# EAGLE design accumulator-undervoltage-protection (EAGLE 5.06)
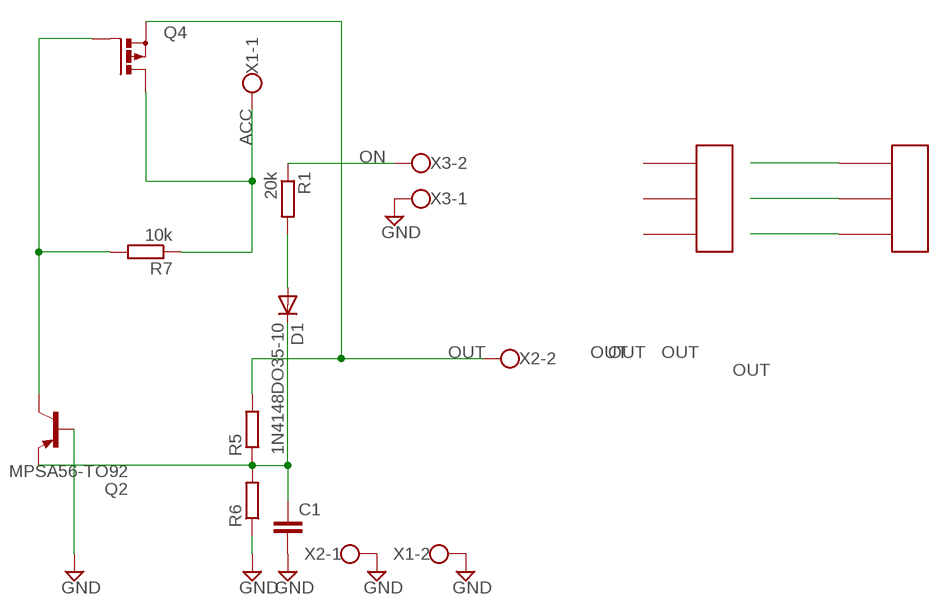
[diagram p0: schematic, sheet 1]

## Parts
C1  C-EU050-024X044  [C050-024X044]
D1  1N4148DO35-10  [DO35-10]
Q2  MPSA56-TO92  [TO92-CBE]
Q4  PMOSFET_PTO220BV  [TO220BV]
R1  20k  R-EU_0207/10  [0207/10]
R5  R-EU_0207/12  [0207/12]
R6  R-EU_0207/12  [0207/12]
R7  10k  R-EU_0207/12  [0207/12]
U$1  MA03-1  [MA03-1]
U$2  MA03-1  [MA03-1]
X1  W237-02P  [W237-132]
X2  W237-02P  [W237-132]
X3  W237-02P  [W237-132]

## Nets
ACC: Q4.D R7.1 U$2.P3 X1.1
GND: C1.2 Q2.B R6.1 X1.2 X2.1 X3.1
N$1: Q2.C Q4.G R7.2
N$3: D1.A R1.2
ON: R1.1 U$2.P1 U$2.P2 X3.2
OUT: Q4.S R5.2 X2.2
VREF: C1.1 D1.C Q2.E R5.1 R6.2
Unconnected: U$1.P1 U$1.P2 U$1.P3

## Library data of the parts
C1 = rcl:C-EU: CAPACITOR, European symbol
D1 = diode:1N4148: DIODE high speed (Philips)
Q2 = transistor-pnp:*-?: PNP Transistor
Q4 = transistor-power:PMOSFET_P: Power MOSFET P-Channel
R1 = rcl:R-EU_: RESISTOR, European symbol
R5-R7 = resistor:R-EU_: RESISTOR, European symbol
U$1 U$2 = my-con:MA03-1
X1-X3 = con-wago-508:W237-02P: WAGO SREW CLAMP

## Board
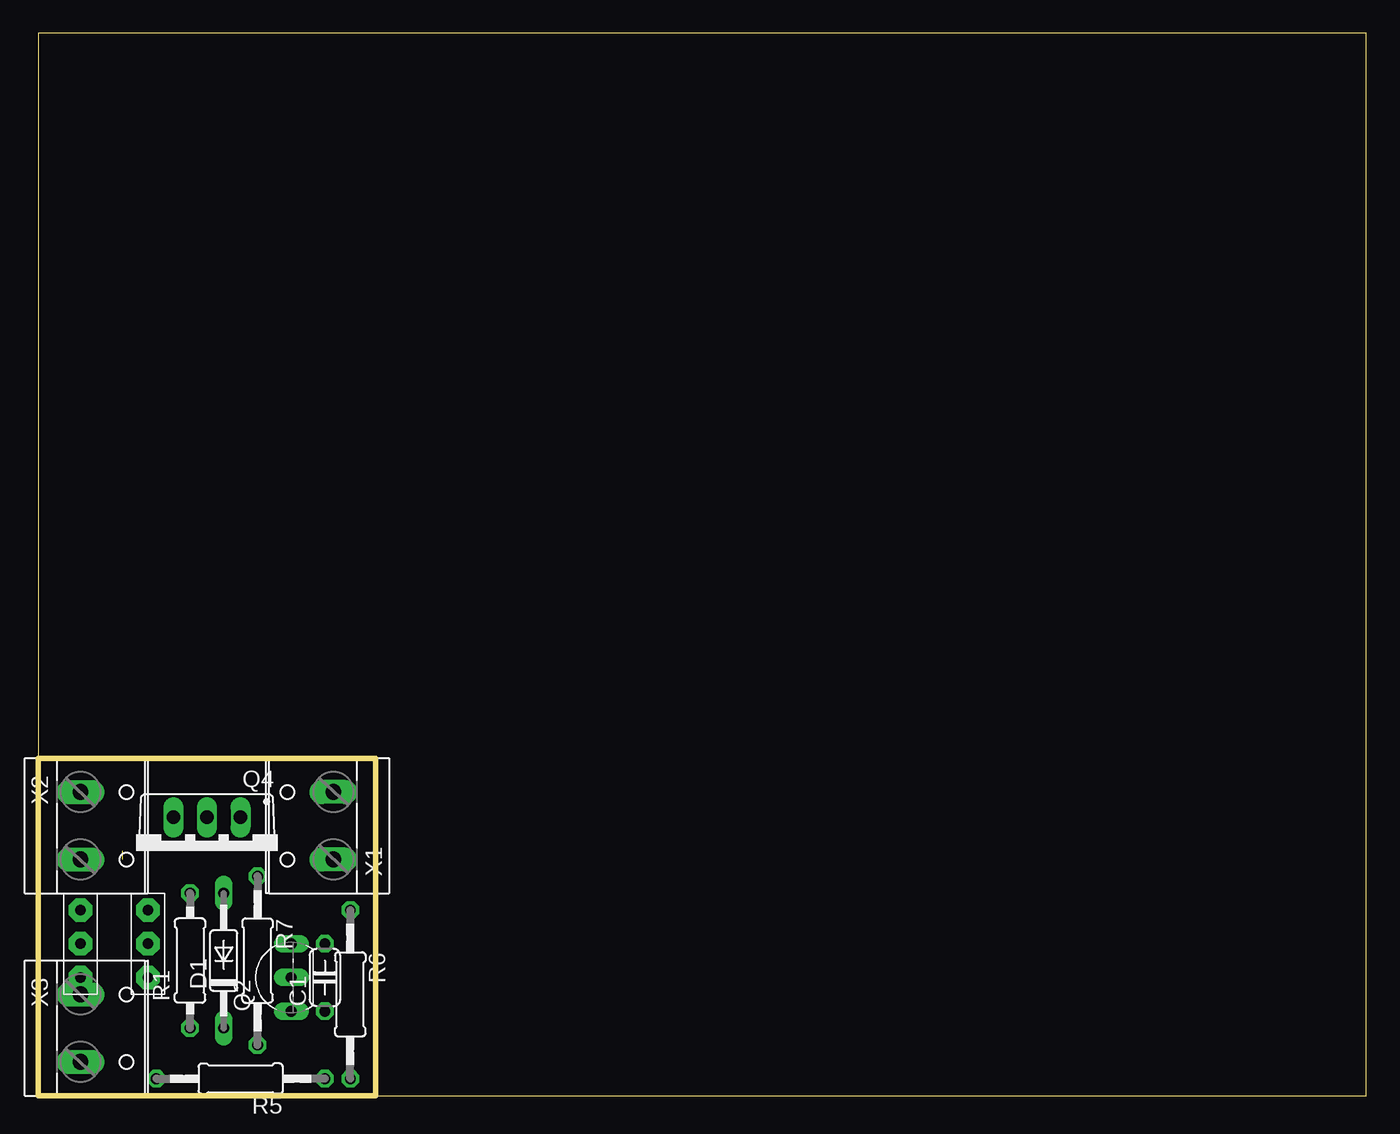
[diagram p1: board, top side]
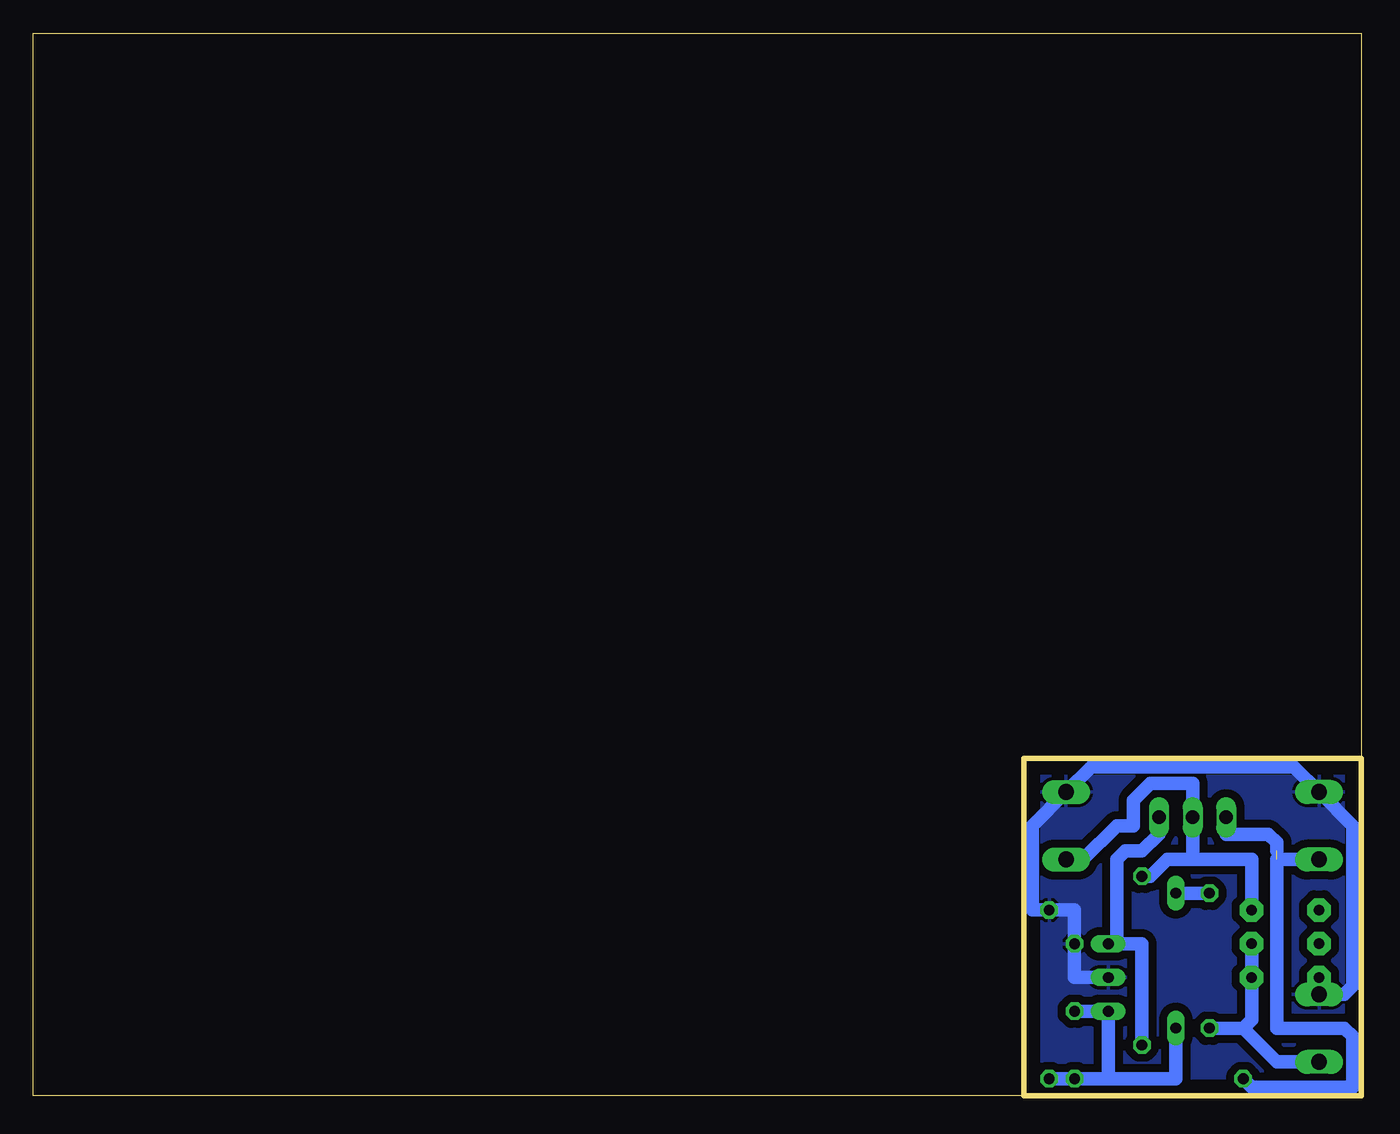
[diagram p2: board, bottom side, seen from below]

Size 100 x 80 mm. Coordinates in mm from the lower left corner, seen from the top.
Outline: 0,0 25.4,0
Outline: 25.4,0 100,0 100,80 0,80 0,25.4
Outline: 0,25.4 0,0
Outline: 0,0 25.4,0
Outline: 25.4,0 25.4,25.4 0,25.4
Outline: 0,25.4 0,0
Copper layers (1*16): Top 0.035mm / dielectric 1.5mm / Bottom 0.035mm
Design rules "default": minimum track width 10mil, minimum drill 24mil, track to track 8mil, track to pad 8mil, pad to pad 8mil, via to via 8mil, smd to smd 8mil, copper to edge 40mil, drill to drill 8mil, minimum pad ring 10mil, minimum via ring 8mil, stop-mask expansion 4mil, vias tented up to drill 0mil, thermal gap 10mil

### Footprints (pad centres in the part's own frame; a part is rotated, then mirrored left to right if it is on the bottom)
C050-024X044 = drill 0.813 octagon: 1 -2.54,0; 2 2.54,0
DO35-10 = drill 0.813 long: A 5.08,0; C -5.08,0
TO92-CBE = drill 0.813 long: B 0,0; C 2.54,0; E -2.54,0
TO220BV = drill 1.016 long: D 0,-2.54; G -2.54,-2.54; S 2.54,-2.54
0207/10 = drill 0.813 octagon: 1 -5.08,0; 2 5.08,0
0207/12 = drill 0.813 octagon: 1 -6.35,0; 2 6.35,0
MA03-1 = drill 0.8 pad 1.778 octagon: P1 -2.54,0; P2 0,0; P3 2.54,0
W237-132 = drill 1.194 long: 1 -2.54,-0.635; 2 2.54,-0.635

### Placement (x,y rotation side)
C1  21.59,8.89 90 top
D1  13.97,10.16 90 top
Q2  19.05,8.89 90 top
Q4  12.7,18.41 180 top
R1  11.43,10.16 90 top
R5  15.24,1.27 180 top
R6  23.5,7.62 270 top
R7  16.51,10.16 270 top
U$1  3.17,11.43 90 top
U$2  8.26,11.43 90 top
X1  21.59,20.32 90 top
X2  3.81,20.32 270 top
X3  3.81,5.08 270 top

### Tracks (layer width: path | path; a pad name or v marks a point on that pad's centre or on a via)
ACC
  Bottom 1.016: R7.1 15.88,16.51 14.61,17.78 13.97,17.78 12.7,17.78 | U$2.P3 8.26,17.78 12.7,17.78 | 12.7,17.78 Q4.D 12.7,23.5 15.88,23.5 17.14,22.23 17.14,20.32 18.41,20.32 20.95,17.78 X1.1
GND
  Bottom 1.016: Q2.B 21.59,8.89 C1.2 21.59,13.97 R6.1 24.77,13.97 24.77,20.32 X1.2 20.32,24.77 5.08,24.77 X2.1 0.64,20.32 0.64,8.26 1.27,7.62 X3.1
  pour Bottom (isolate 0.61): 0,25.4 25.4,25.4 25.4,0 0,0
N$1
  Bottom 1.016: 18.41,11.43 16.51,11.43 R7.2 | 18.41,11.43 Q2.C | Q4.G 15.24,19.68 16.51,18.41 17.78,18.41 18.41,17.78 18.41,11.43
N$3
  Bottom 1.016: R1.2 D1.A
ON
  Bottom 1.016: 8.89,5.08 R1.1 | 8.89,5.08 6.35,2.54 X3.2 | 8.89,5.08 8.26,5.71 U$2.P1 U$2.P2
OUT  (1 unrouted)
  Bottom 1.016: R5.2 8.26,0.64 0.64,0.64 0.64,4.45 1.27,5.08 6.35,5.08 6.35,17.78 3.81,17.78 X2.2 | 6.35,18.41 6.35,19.05 6.99,19.68 10.16,19.68 Q4.S
VREF
  Bottom 1.016: C1.1 Q2.E 19.05,3.17 19.05,1.27 | R6.2 R5.1 19.05,1.27 | 19.05,1.27 13.97,1.27 D1.C